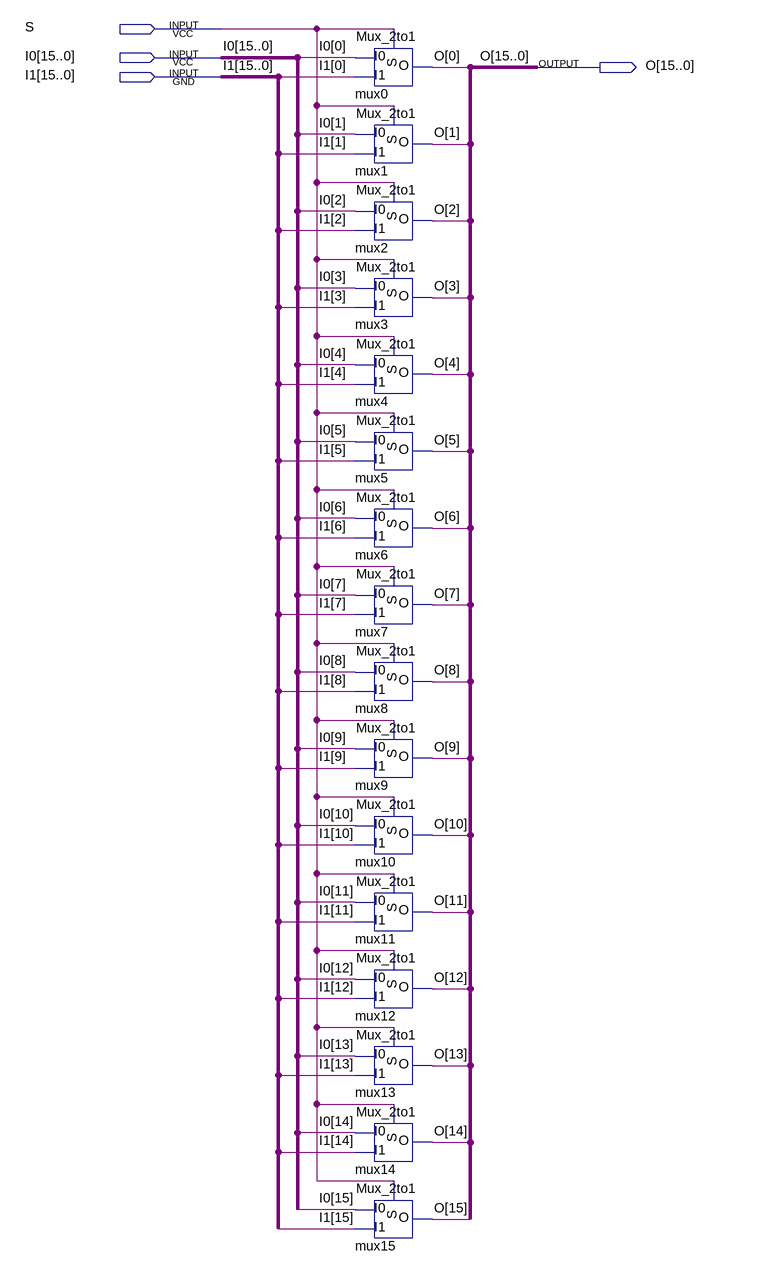
[diagram p0: schematic sheet]
// Quartus schematic Mux16_2to1.bdf as structural Verilog: 16 symbols, 4 pins
module Mux16_2to1 (
  input  S,
  input  [15:0] I0,
  input  [15:0] I1,
  output [15:0] O
);

  Mux_2to1 mux0 (.S(S), .I0(I0[0]), .I1(I1[0]), .O(O[0]));
  Mux_2to1 mux1 (.S(S), .I0(I0[1]), .I1(I1[1]), .O(O[1]));
  Mux_2to1 mux2 (.S(S), .I0(I0[2]), .I1(I1[2]), .O(O[2]));
  Mux_2to1 mux3 (.S(S), .I0(I0[3]), .I1(I1[3]), .O(O[3]));
  Mux_2to1 mux4 (.S(S), .I0(I0[4]), .I1(I1[4]), .O(O[4]));
  Mux_2to1 mux5 (.S(S), .I0(I0[5]), .I1(I1[5]), .O(O[5]));
  Mux_2to1 mux6 (.S(S), .I0(I0[6]), .I1(I1[6]), .O(O[6]));
  Mux_2to1 mux7 (.S(S), .I0(I0[7]), .I1(I1[7]), .O(O[7]));
  Mux_2to1 mux8 (.S(S), .I0(I0[8]), .I1(I1[8]), .O(O[8]));
  Mux_2to1 mux9 (.S(S), .I0(I0[9]), .I1(I1[9]), .O(O[9]));
  Mux_2to1 mux10 (.S(S), .I0(I0[10]), .I1(I1[10]), .O(O[10]));
  Mux_2to1 mux11 (.S(S), .I0(I0[11]), .I1(I1[11]), .O(O[11]));
  Mux_2to1 mux12 (.S(S), .I0(I0[12]), .I1(I1[12]), .O(O[12]));
  Mux_2to1 mux13 (.S(S), .I0(I0[13]), .I1(I1[13]), .O(O[13]));
  Mux_2to1 mux14 (.S(S), .I0(I0[14]), .I1(I1[14]), .O(O[14]));
  Mux_2to1 mux15 (.S(S), .I0(I0[15]), .I1(I1[15]), .O(O[15]));
endmodule
